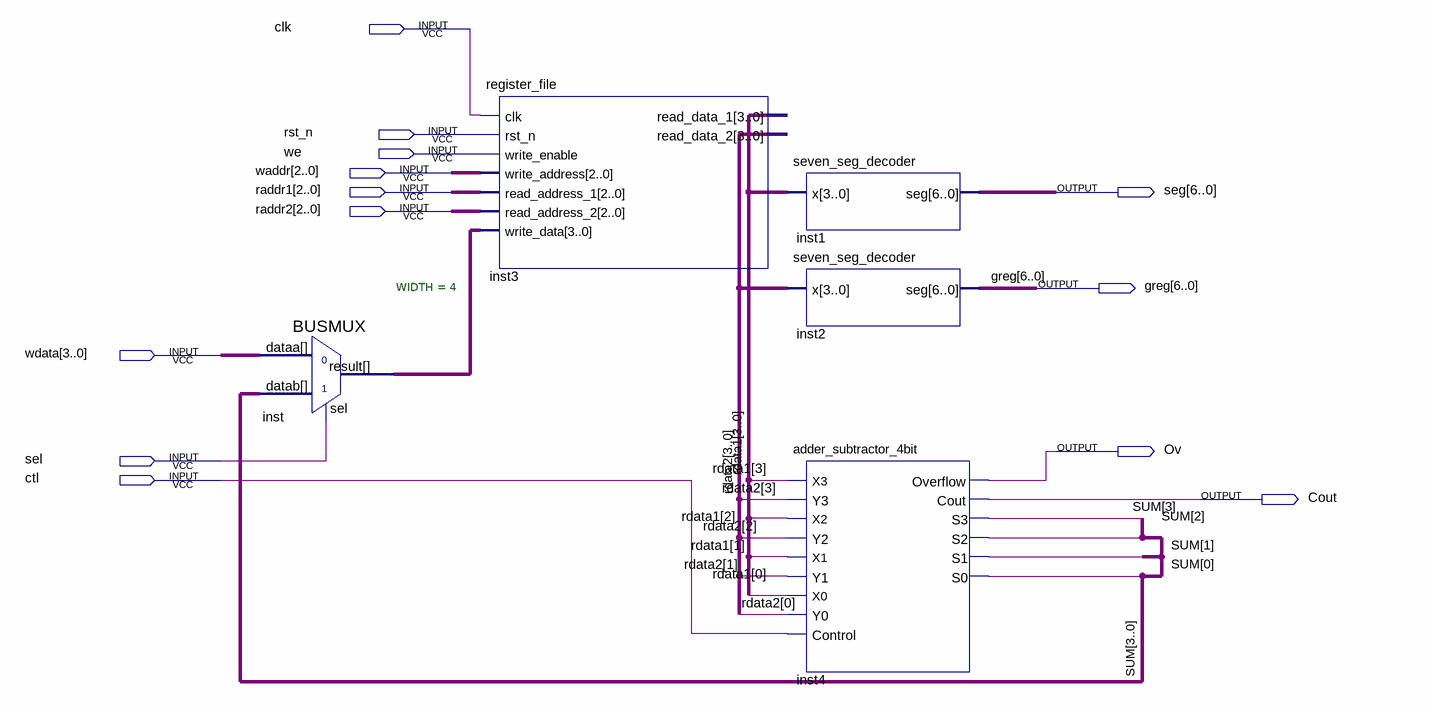
[diagram p0: schematic sheet]
// Quartus schematic Lab12Step3.bdf as structural Verilog: 5 symbols, 13 pins
module Lab12Step3 (
  input  clk,
  input  rst_n,
  input  we,
  input  [2:0] waddr,
  input  [2:0] raddr1,
  input  [2:0] raddr2,
  input  [3:0] wdata,
  input  sel,
  input  ctl,
  output [6:0] seg,
  output [6:0] greg,
  output Ov,
  output Cout
);

  wire [3:0] inst_result, rdata1, rdata2, SUM;

  BUSMUX #(.WIDTH(4)) inst (.datab(SUM), .sel(sel), .dataa(wdata), .result(inst_result));
  register_file inst3 (
    .clk(clk), .rst_n(rst_n), .write_enable(we), .write_address(waddr), .read_address_1(raddr1),
    .read_address_2(raddr2), .write_data(inst_result), .read_data_1(rdata1), .read_data_2(rdata2));
  seven_seg_decoder inst1 (.x(rdata1), .seg(seg));
  seven_seg_decoder inst2 (.x(rdata2), .seg(greg));
  adder_subtractor_4bit inst4 (
    .X3(rdata1[3]), .Y3(rdata2[3]), .X2(rdata1[2]), .Y2(rdata2[2]), .X1(rdata1[1]), .Y1(rdata2[1]),
    .X0(rdata1[0]), .Y0(rdata2[0]), .Control(ctl), .Overflow(Ov), .Cout(Cout), .S3(SUM[3]), .S2(SUM[2]),
    .S1(SUM[1]), .S0(SUM[0]));
endmodule
